# EasyEDA Pro project ProPrj_感应灯_2024-03-13_07-09-23_2025-06-12.epro

# Schematic 感应灯
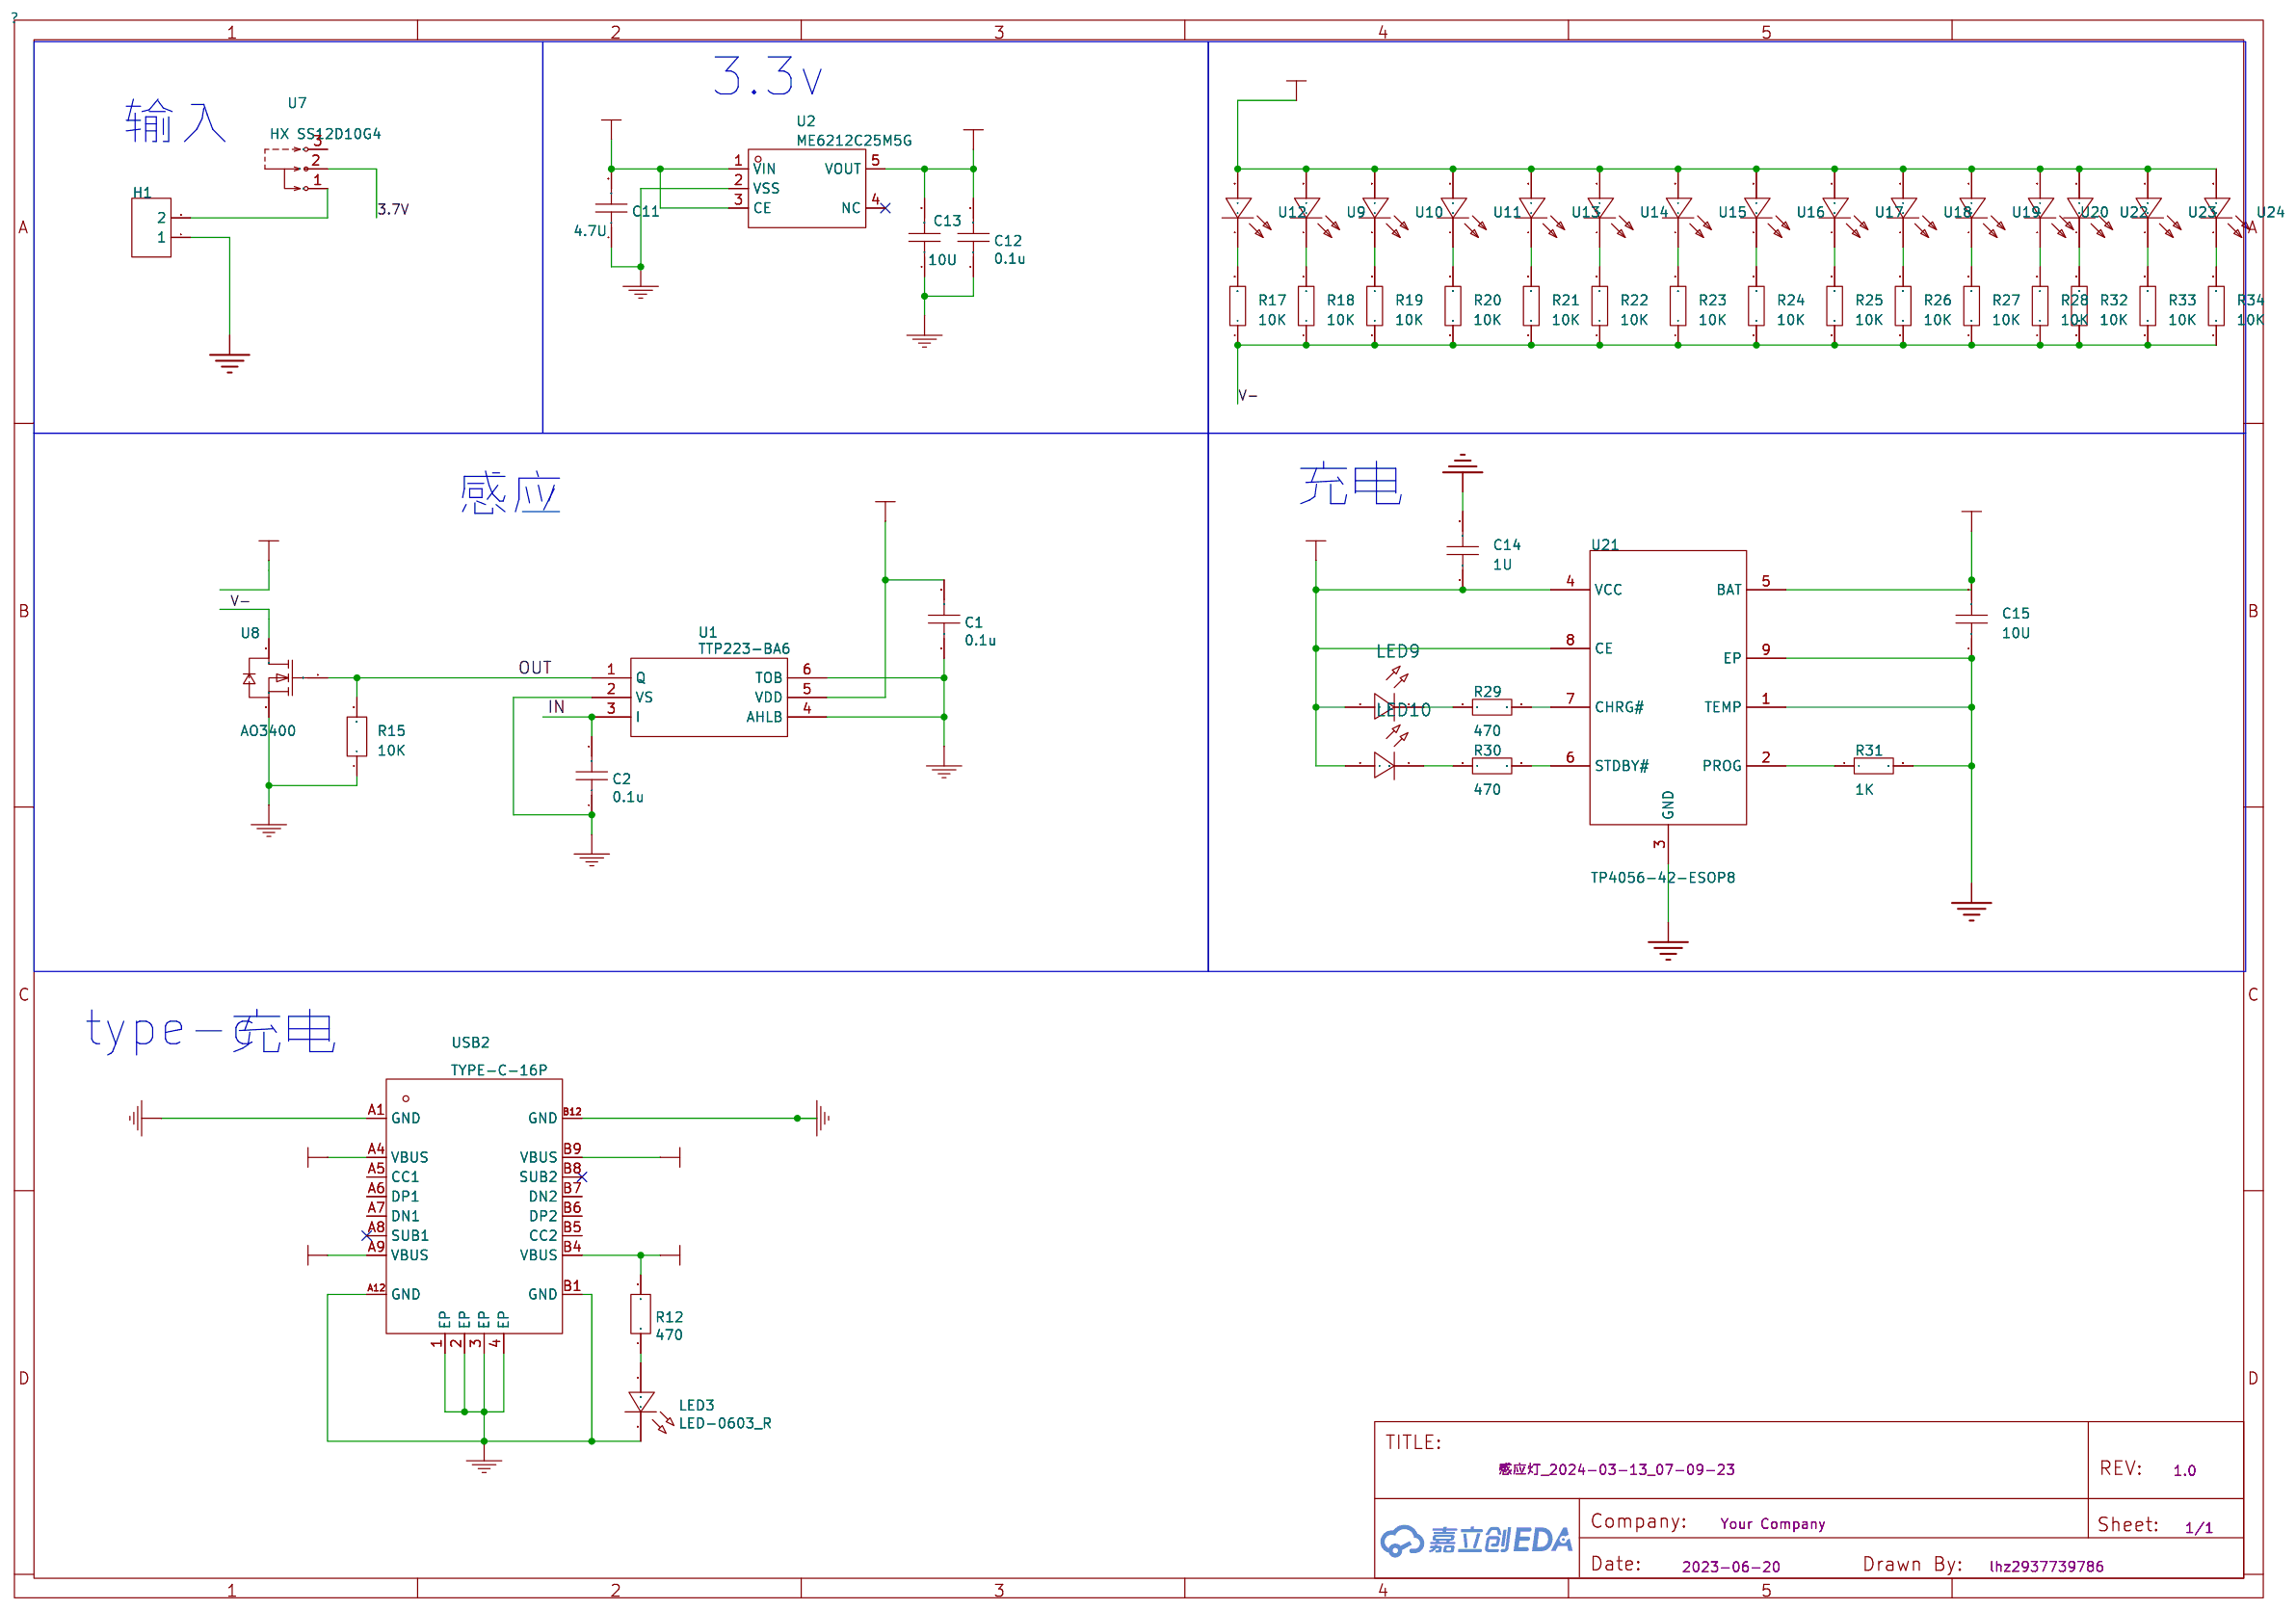
[diagram p0: schematic sheet]

## Parts
C1  0.1u  [footprint_1e94]
C2  0.1u  [footprint_1e94]
C11  4.7U  [footprint_d063]
C12  0.1u  [footprint_d063]
C13  10U  [footprint_d063]
C14  1U  [C0603]
C15  10U  [C0603]
H1  -  [HDR-TH_2P-P2.54-V-F]
LED3  LED-0603_R  [footprint_1210]
LED9  -  [LED_0603]
LED10  -  [LED_0603]
R12  470  [footprint_1dde]
R15  10K  [footprint_4dfc]
R17  10K  [R0805]
R18  10K  [R0805]
R19  10K  [R0805]
R20  10K  [R0805]
R21  10K  [R0805]
R22  10K  [R0805]
R23  10K  [R0805]
R24  10K  [R0805]
R25  10K  [R0805]
R26  10K  [R0805]
R27  10K  [R0805]
R28  10K  [R0805]
R29  470  [R0805]
R30  470  [R0805]
R31  1K  [R0805]
R32  10K  [R0805]
R33  10K  [R0805]
R34  10K  [R0805]
U1  TTP223-BA6  [footprint_07fe]
U2  ME6212C25M5G  [footprint_203e]
U7  HX SS12D10G4  [footprint_a0a6]
U8  AO3400  [footprint_8e82]
U9  -  [led-smd_l3.5-w2.8-r-fd-white]
U10  -  [led-smd_l3.5-w2.8-r-fd-white]
U11  -  [led-smd_l3.5-w2.8-r-fd-white]
U12  -  [led-smd_l3.5-w2.8-r-fd-white]
U13  -  [led-smd_l3.5-w2.8-r-fd-white]
U14  -  [led-smd_l3.5-w2.8-r-fd-white]
U15  -  [led-smd_l3.5-w2.8-r-fd-white]
U16  -  [led-smd_l3.5-w2.8-r-fd-white]
U17  -  [led-smd_l3.5-w2.8-r-fd-white]
U18  -  [led-smd_l3.5-w2.8-r-fd-white]
U19  -  [led-smd_l3.5-w2.8-r-fd-white]
U20  -  [led-smd_l3.5-w2.8-r-fd-white]
U21  TP4056-42-ESOP8  [ESOP-8_L4.9-W3.9-P1.27-LS6.0-BL-EP]
U22  -  [led-smd_l3.5-w2.8-r-fd-white]
U23  -  [led-smd_l3.5-w2.8-r-fd-white]
U24  -  [led-smd_l3.5-w2.8-r-fd-white]
USB2  TYPE-C-16P  [footprint_feef]

## Library data of the parts
C1 C2 C12 = 0.1u
C11 = 4.7U
C13 = 10U
C14 C15 = CAP_0603: Supplier Footprint: 0603
H1 = HDR-F_2.54_1x2P: Supplier Part: C49661; Supplier Footprint: 插件
LED3 = LED-0603_R: Manufacturer: EVERLIGHT(台湾亿光); Manufacturer Part: 19-217/R6C-AL1M2VY/3T; Supplier Part: C72044; Supplier: LCSC
LED9 LED10 = LED_0603-R: Supplier Footprint: 0603
R12 = 470
R15 = 10K
R17-R34 = Res_0805: Supplier Footprint: 0805
U1 = TTP223-BA6: Supplier: LCSC; Manufacturer: null; Supplier Part: C80757; JLCPCB Part Class: Extended Part
U2 = ME6212C25M5G: Supplier: LCSC; Supplier Part: C2911282; Manufacturer: MICRONE(南京微盟); JLCPCB Part Class: Extended Part; link: https://so.szlcsc.com/global.html?k=C2911282&amp;ref=editor
U7 = HX SS12D10G4: Supplier: LCSC; Supplier Part: C5149841; Manufacturer: hanxia(韩下); link: https://atta.szlcsc.com/upload/public/pdf/source/20220907/2020D7183ED16DD6E2B9F5A13FB144CF.pdf; JLCPCB Part Class: Extended Part
U8 = AO3400: Supplier: LCSC; Supplier Part: C5224189; Manufacturer: ElecSuper(静芯微）; JLCPCB Part Class: Extended Part; link: https://so.szlcsc.com/global.html?k=C5224189&amp;ref=editor
U9-U20 U22-U24 = led2835: LCSC Part Name: LED2835; Supplier Part: C9900002597; Manufacturer Part: LED2835; LCSC Stock: 0; LCSC On Sale: 0; Supplier Footprint: 2835; Price: 0; JLCPCB Part Class: Extended Part; JLCPCB Stock: 0; JLCPCB On Sale: 1; Datasheet: 2021-11-27/497147W/184e61ff2eea470fa2087b84cc62277a/C28438762835白色.PDF; Supplier: LCSC
U21 = TP4056: 充电电池的类型:-;电池单元组数:-;最大充电电流:-;充满的电池组电压:-;最大供应电压:-;; Supplier Part: C16581; Manufacturer: TOPPOWER(南京拓微); Supplier Footprint: ESOP-8; JLCPCB Part Class: Basic Part; Datasheet: https://atta.szlcsc.com/upload/public/pdf/source/20190626/C16581_611BCF5D7CF554EAE465137A8F68DB3E.pdf; Supplier: LCSC
USB2 = TYPE-C-16P: Supplier: LCSC; Supplier Part: C709357; Manufacturer: Shenzhen Kinghelm Elec; Manufacturer Part: KH-TYPE-C-16P; JLCPCB Part Class: Extended Part

## Nets
3.3V: C1.2 C12.2 C13.2 U1.5(VDD) U2.5(VOUT)
3.7V: C11.2 C15.2 U2.1(VIN) U2.3(CE) U7.2 U9.2(A) U10.2(A) U11.2(A) U12.2(A) U13.2(A) U14.2(A) U15.2(A) U16.2(A) U17.2(A) U18.2(A) U19.2(A) U20.2(A) U21.5(BAT) U22.2(A) U23.2(A) U24.2(A)
5V: C14.1 LED9.2(A) LED10.2(A) R12.2 U21.4(VCC) U21.8(CE) USB2.A4(VBUS) USB2.A9(VBUS) USB2.B4(VBUS) USB2.B9(VBUS)
GND: C1.1 C2.1 C11.1 C12.1 C13.1 C14.2 C15.1 H1.1 LED3.2 R15.1 R31.2 U1.2(VS) U1.4(AHLB) U1.6(TOB) U2.2(VSS) U8.2(S) U21.1(TEMP) U21.3(GND) U21.9(EP) USB2.1(EP) USB2.2(EP) USB2.3(EP) USB2.4(EP) USB2.A1(GND) USB2.A12(GND) USB2.B1(GND) USB2.B12(GND)
IN: C2.2 U1.3(I)
OUT: R15.2 U1.1(Q) U8.1(G)
V-: R17.1 R18.1 R19.1 R20.1 R21.1 R22.1 R23.1 R24.1 R25.1 R26.1 R27.1 R28.1 R32.1 R33.1 R34.1 U8.3(D)
$1N831: H1.2 U7.1
$1N2229: R17.2 U12.1(K)
$1N2232: R18.2 U9.1(K)
$1N2235: R19.2 U10.1(K)
$1N2238: R20.2 U11.1(K)
$1N2241: R21.2 U13.1(K)
$1N2244: R22.2 U14.1(K)
$1N2247: R23.2 U15.1(K)
$1N2250: R24.2 U16.1(K)
$1N2253: R25.2 U17.1(K)
$1N2256: R26.2 U18.1(K)
$1N2259: R27.2 U19.1(K)
$1N2262: R28.2 U20.1(K)
$1N2508: R29.2 U21.7(CHRG#)
$1N2511: R30.2 U21.6(STDBY#)
$1N2564: LED9.1(C) R29.1
$1N2567: LED10.1(C) R30.1
$1N2736: R31.1 U21.2(PROG)
$1N3041: LED3.1 R12.1
$1N3274: R32.2 U22.1(K)
$1N3276: R33.2 U23.1(K)
$1N3278: R34.2 U24.1(K)

Not connected (* = marked no-connect by the designer): U2 4(NC)*; U7 3; USB2 A5(CC1) A6(DP1) A7(DN1) A8(SUB1)* B5(CC2) B6(DP2) B7(DN2) B8(SUB2)*

## Notes on the sheet
- 3.3v
- 输入
- 充电
- 感应
- type-c
- 充电

# Board PCB_感应灯
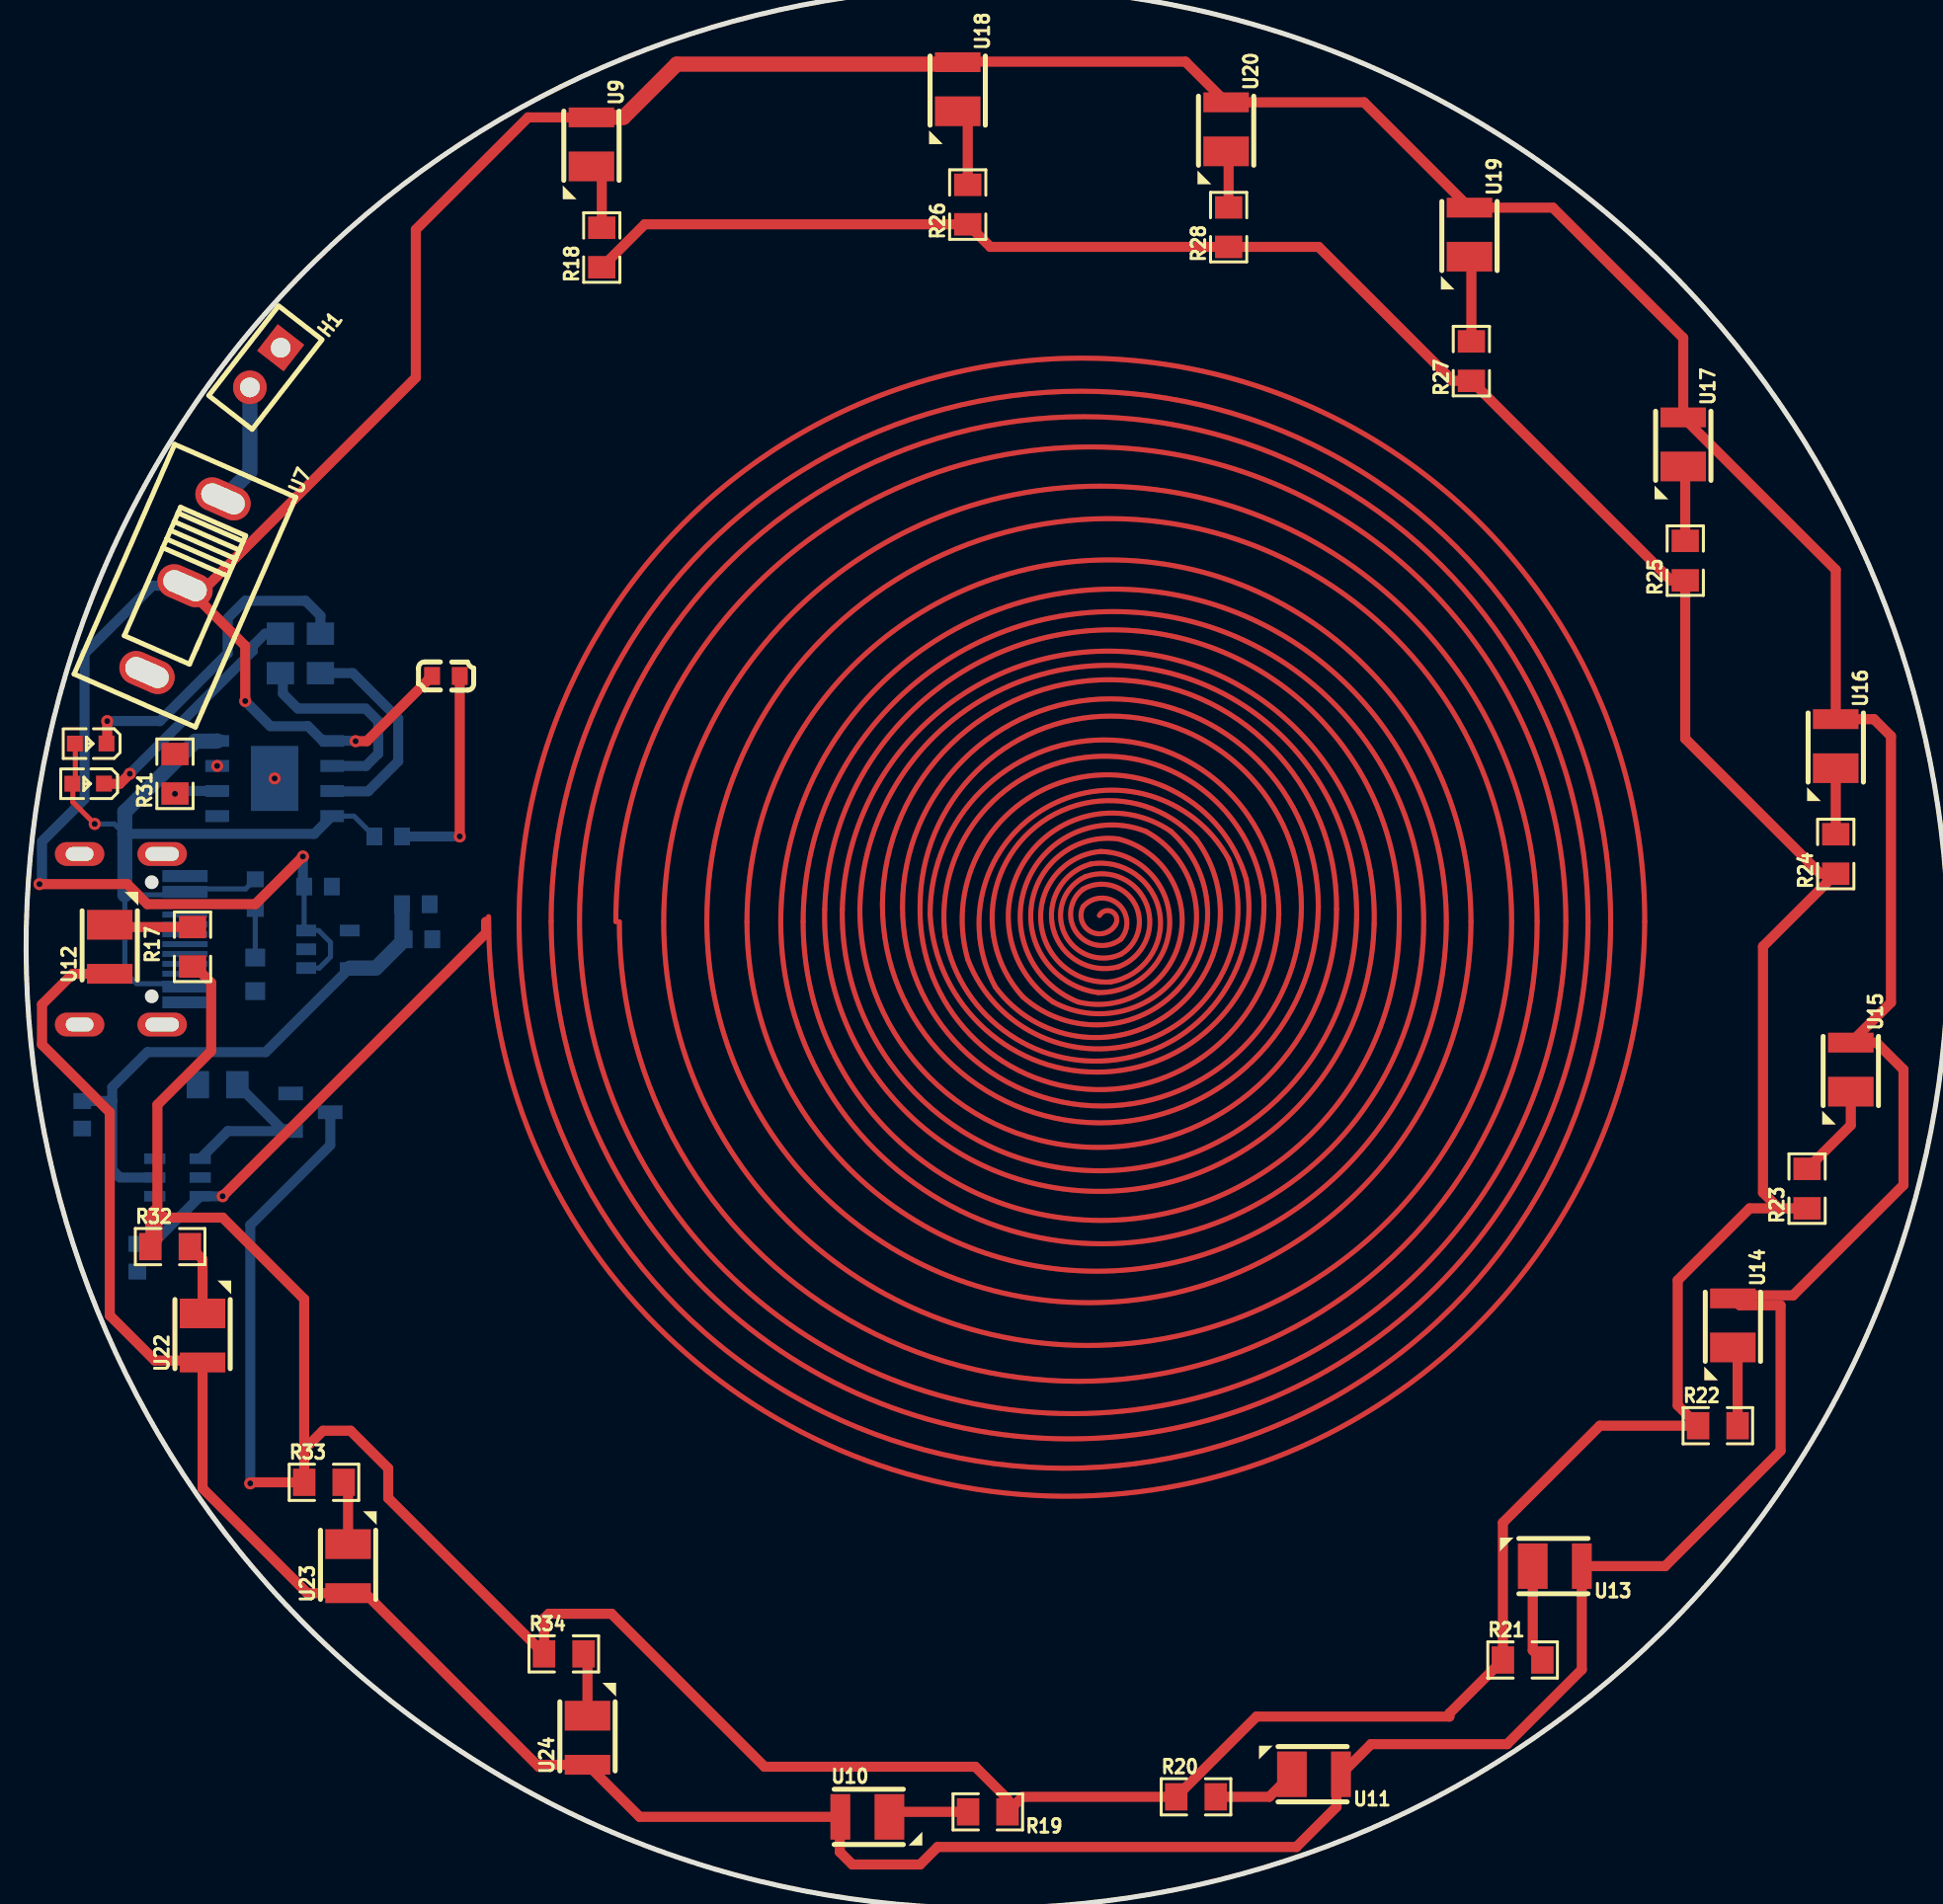
[diagram p1: board, top side]
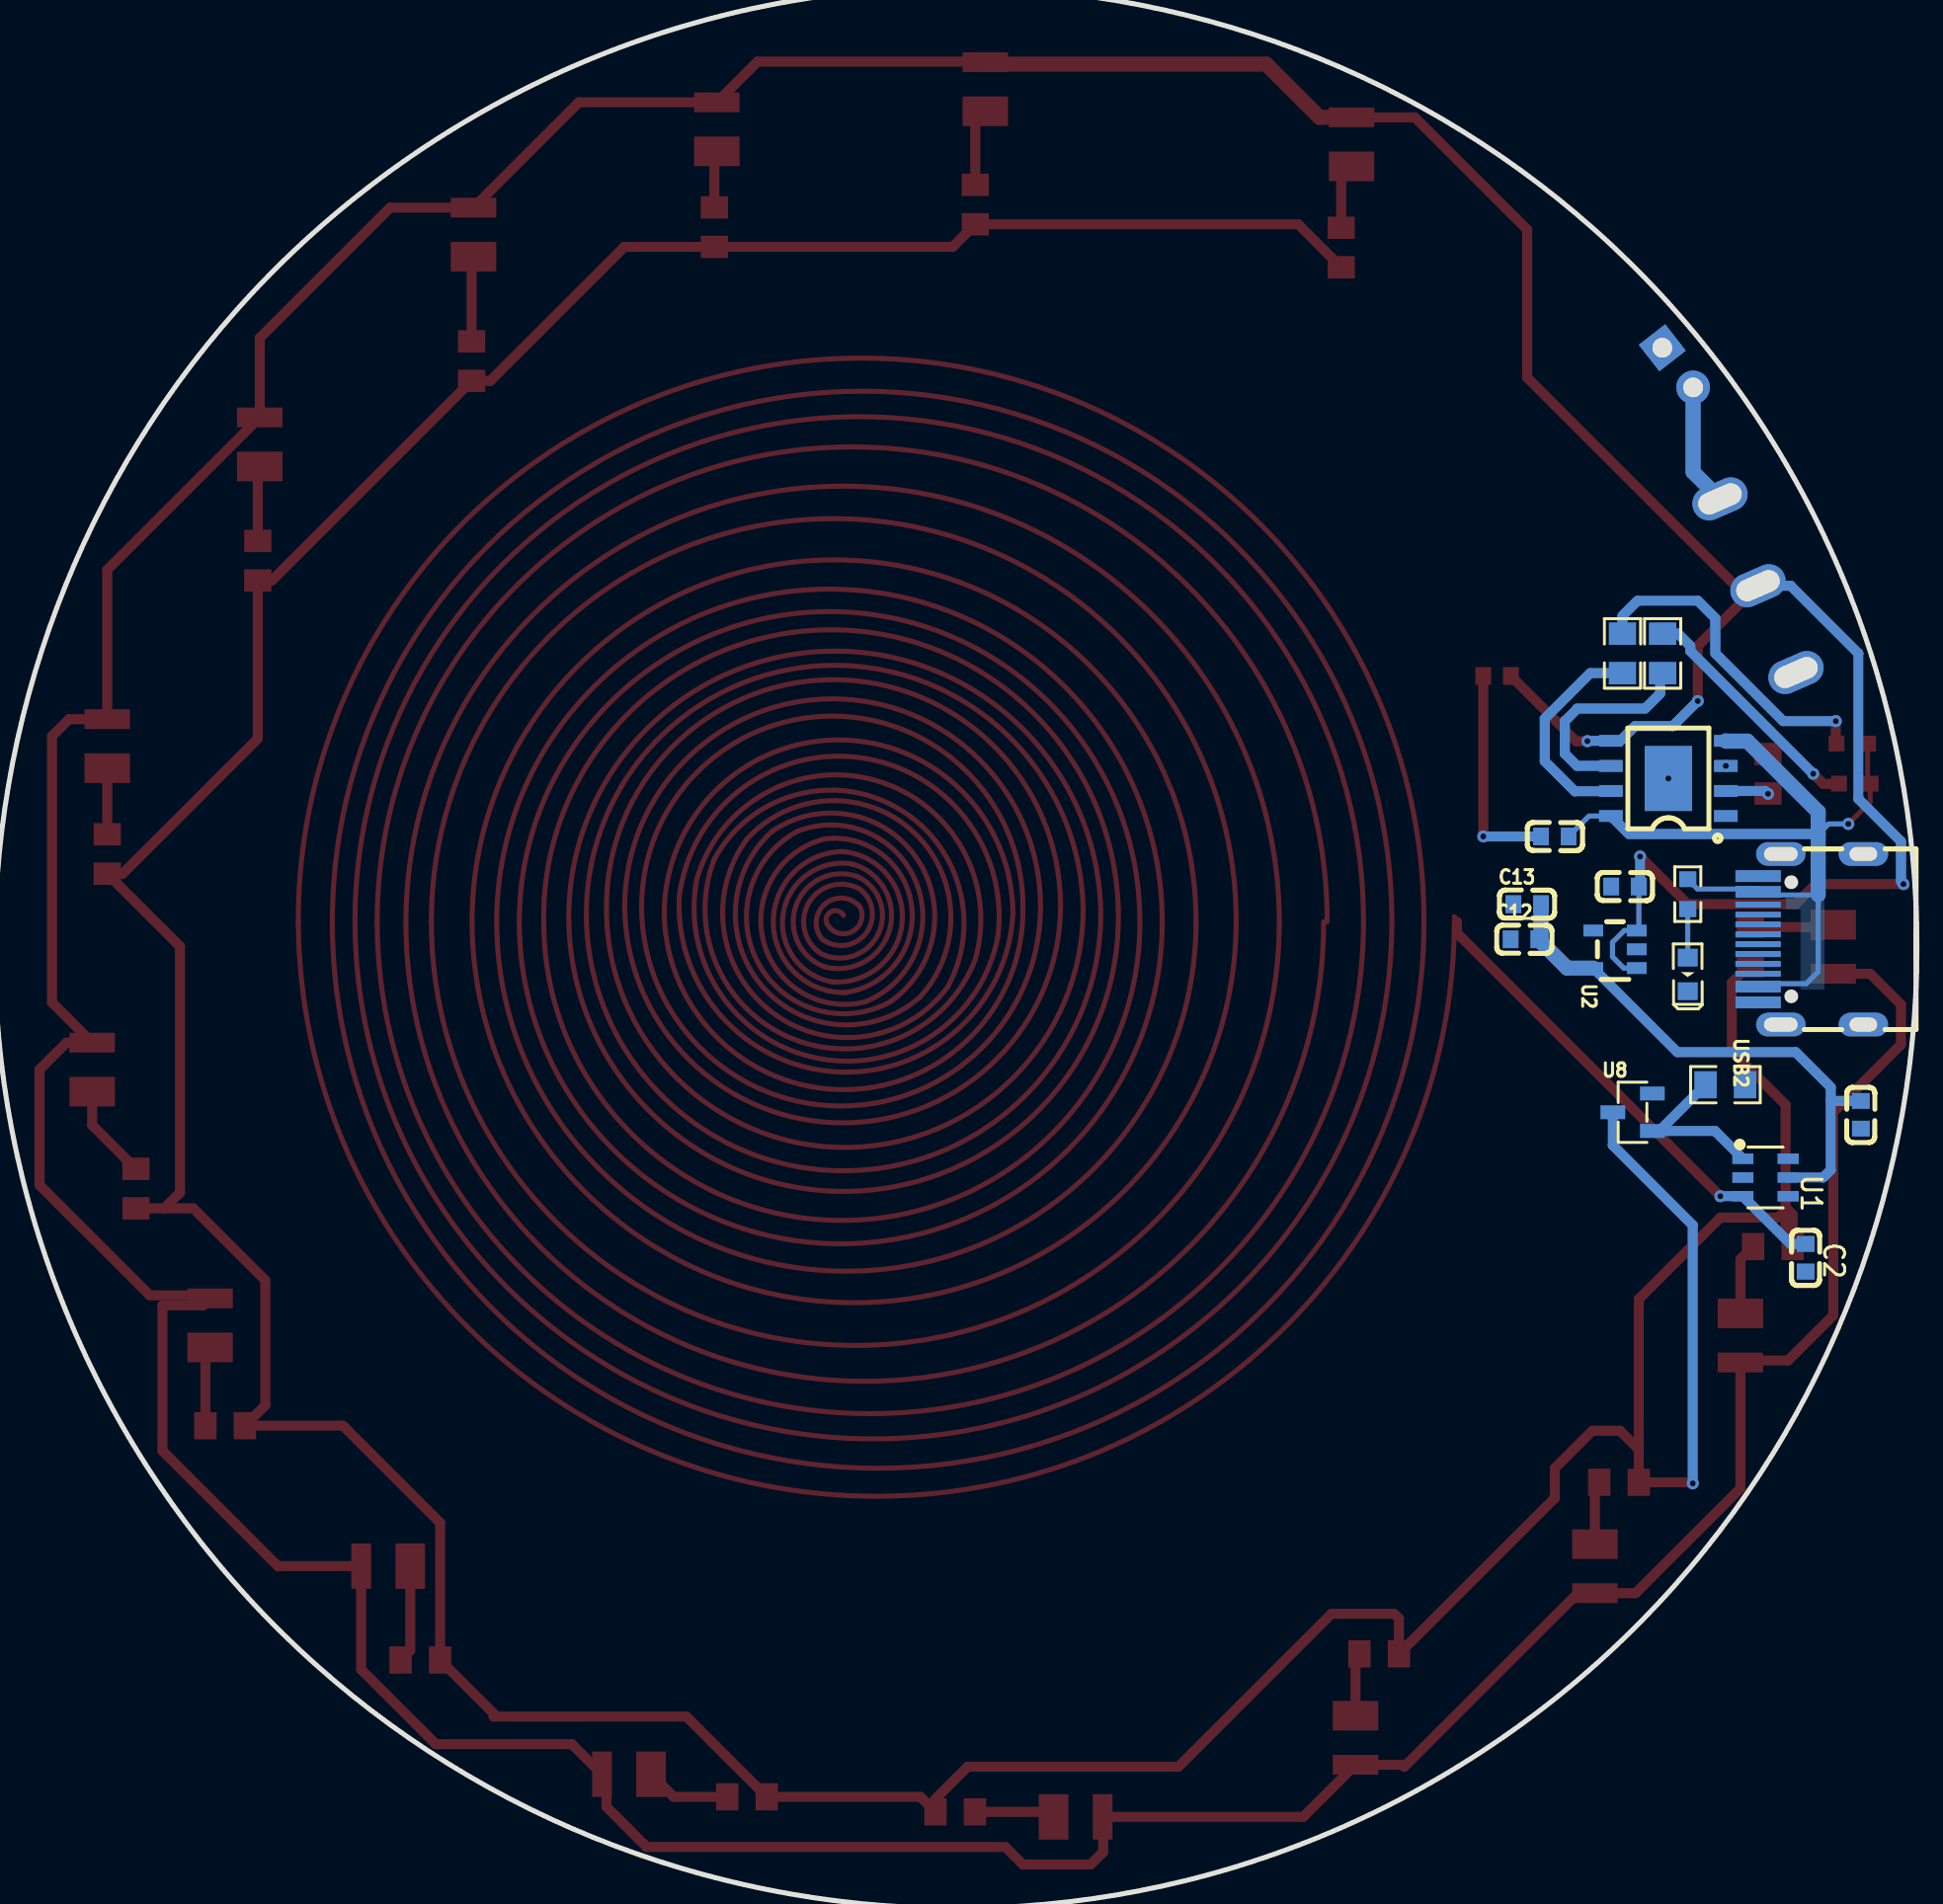
[diagram p2: board, bottom side, seen from below]

Outline 97.3 x 97.3 mm; copper layers: Top Layer, Bottom Layer. Coordinates in mm from the lower left corner of the outline.
Outline path: 89.7,22.53 arc(7.48,74.56) 89.7,22.54
Stack: Top Layer 0.035mm / Dielectric1 1.51mm FR4 er 4.5 / Bottom Layer 0.035mm

## Design rules (mm)
spacing Default (default): track to track 0.152, other pairs 0 to 0.152
track width Default (default): min 0.254, default 0.254, max 25.4
differential pair differentialPair (default): width min 0.127, default 0.254, max 2.54; gap min 0.152, default 0.152
via Default (default): diameter min 0.61, default 0.61, max 100.025; hole min 0.305, default 0.305, max 59.995
net GND uses gge1959

## Placement (name value [footprint] x y rotation side)
C1  0.1u  [footprint_1e94]  2.84 40.19 90 bottom
C2  0.1u  [footprint_1e94]  5.63 32.95 90 bottom
C11  4.7U  [footprint_d063]  14.77 51.75 180 bottom
C12  0.1u  [footprint_d063]  19.86 49.08 180 bottom
C13  10U  [footprint_d063]  19.73 50.86 180 bottom
C14  1U  [C0603]  18.33 54.29 0 bottom
C15  10U  [C0603]  21.25 62.41 180 top
H1  -  [HDR-TH_2P-P2.54-V-F]  12.11 78.03 232.1 top
LED3  LED-0603_R  [footprint_1210]  11.6 47.3 270 bottom
LED9  -  [LED_0603]  3.22 58.98 180 top
LED10  -  [LED_0603]  3.09 56.95 180 top
R12  470  [footprint_1dde]  11.6 51.36 90 bottom
R15  10K  [footprint_4dfc]  9.69 41.71 0 bottom
R17  10K  [R0805]  8.42 48.7 90 top
R18  10K  [R0805]  29.14 84.11 90 top
R19  10K  [R0805]  48.68 4.88 180 top
R20  10K  [R0805]  59.22 5.64 0 top
R21  10K  [R0805]  75.76 12.57 0 top
R22  10K  [R0805]  85.64 24.44 0 top
R23  10K  [R0805]  90.16 36.45 90 top
R24  10K  [R0805]  91.61 53.4 90 top
R25  10K  [R0805]  83.99 68.26 90 top
R26  10K  [R0805]  47.67 86.29 90 top
R27  10K  [R0805]  73.16 78.36 90 top
R28  10K  [R0805]  60.88 85.15 90 top
R29  470  [R0805]  14.9 63.56 270 bottom
R30  470  [R0805]  12.87 63.56 270 bottom
R31  1K  [R0805]  7.54 57.46 90 top
R32  10K  [R0805]  7.29 33.51 0 top
R33  10K  [R0805]  15.08 21.57 0 top
R34  10K  [R0805]  27.22 12.88 0 top
U1  TTP223-BA6  [footprint_07fe]  7.66 37.01 270 bottom
U2  ME6212C25M5G  [footprint_203e]  15.28 48.57 90 bottom
U7  HX SS12D10G4  [footprint_a0a6]  8.04 66.99 246.4 top
U8  AO3400  [footprint_8e82]  14.39 40.32 180 bottom
U9  -  [led-smd_l3.5-w2.8-r-fd-white]  28.62 89.59 270 top
U10  -  [led-smd_l3.5-w2.8-r-fd-white]  42.33 4.63 0 top
U11  -  [led-smd_l3.5-w2.8-r-fd-white]  65.45 6.79 180 top
U12  -  [led-smd_l3.5-w2.8-r-fd-white]  4.23 48.44 90 top
U13  -  [led-smd_l3.5-w2.8-r-fd-white]  77.64 17.33 180 top
U14  -  [led-smd_l3.5-w2.8-r-fd-white]  86.4 29.77 270 top
U15  -  [led-smd_l3.5-w2.8-r-fd-white]  92.37 42.73 270 top
U16  -  [led-smd_l3.5-w2.8-r-fd-white]  91.61 59.11 270 top
U17  -  [led-smd_l3.5-w2.8-r-fd-white]  83.89 74.39 270 top
U18  -  [led-smd_l3.5-w2.8-r-fd-white]  47.16 92.39 270 top
U19  -  [led-smd_l3.5-w2.8-r-fd-white]  73.07 85.02 270 top
U20  -  [led-smd_l3.5-w2.8-r-fd-white]  60.75 90.35 270 top
U21  TP4056-42-ESOP8  [ESOP-8_L4.9-W3.9-P1.27-LS6.0-BL-EP]  12.58 57.22 90 bottom
U22  -  [led-smd_l3.5-w2.8-r-fd-white]  8.93 28.76 90 top
U23  -  [led-smd_l3.5-w2.8-r-fd-white]  16.3 17.07 90 top
U24  -  [led-smd_l3.5-w2.8-r-fd-white]  28.42 8.38 90 top
USB2  TYPE-C-16P  [footprint_feef]  5.12 49.08 90 bottom

## Footprints (pads in the part's own frame, mm; a bottom-side part is the same pattern mirrored in y, then rotated)
C0603
  rect 0.8x0.9 smd: 1(-0.7,0) 2(0.7,0)
ESOP-8_L4.9-W3.9-P1.27-LS6.0-BL-EP
  rect 0.6x1.2 smd: 1(-1.905,-2.909) 2(-0.635,-2.909) 3(0.635,-2.909) 4(1.905,-2.909) 5(1.905,2.909) 6(0.635,2.909) 7(-0.635,2.909) 8(-1.905,2.909)
  rect 3.3x2.4 smd: 9(0,0)
footprint_1dde
  rect 0.806x0.864 smd: 1(-0.753,0) 2(0.753,0)
footprint_1e94
  rect 0.8x0.9 smd: 1(-0.7,0) 2(0.7,0)
footprint_4dfc
  rect 1.133x1.377 smd: 1(-1,0) 2(1,0)
footprint_07fe
  rect 0.532x1.072 smd: 1(-0.95,-1.149) 2(0,-1.149) 3(0.95,-1.149) 4(0.95,1.149) 5(0,1.149) 6(-0.95,1.149)
footprint_8e82
  rect 1.25x0.7 smd: 1(1,-0.95) 2(1,0.95) 3(-1,0)
footprint_203e
  rect 0.6x1 smd: 1(-0.95,-1.1) 2(0,-1.1) 3(0.95,-1.1) 4(0.95,1.1) 5(-0.95,1.1)
footprint_1210
  rect 0.9x1 smd: 1(-0.85,0) 2(0.85,0)
footprint_a0a6
  oval 1.7x2.9 hole 1.1x2.3: 1(-4.8,0) 2(0.001,0) 3(4.8,0)
footprint_d063
  rect 0.8x0.9 smd: 1(-0.7,0) 2(0.7,0)
footprint_feef
  oval 1.2x2.5 hole 0.7x1.7: 1(-4.32,1.765) 2(4.32,1.765)
  oval 1.2x2.5 hole 0.7x1.4: 3(-4.32,-2.415) 4(4.32,-2.415)
  rect 0.3x2.3 smd: A1(-3.35,2.915) A4(-2.55,2.915) A5(-1.25,2.915) A6(-0.25,2.915) A7(0.25,2.915) A8(1.25,2.915) A9(2.55,2.915) A12(3.35,2.915) B1(3.05,2.915) B4(2.25,2.915) B5(1.75,2.915) B6(0.75,2.915) B7(-0.75,2.915) B8(-1.75,2.915) B9(-2.25,2.915) B12(-3.05,2.915)
HDR-TH_2P-P2.54-V-F
  rect 1.7x1.7 hole 1: 1(-1.27,0)
  round 1.7 hole 1: 2(1.27,0)
led-smd_l3.5-w2.8-r-fd-white
  rect 1.5x2.301 smd: 1(1.369,0)
  rect 1x2.301 smd: 2(-1.115,0)
LED_0603
  rect 0.8x0.8 smd: 1(-0.851,-0.01) 2(0.75,-0.005)
R0805
  rect 1.133x1.377 smd: 1(-1,0) 2(1,0)

## Nets
As in the schematic.

Pads without a net: U2 4; U7 3; USB2 A5 A6 A7 A8 B5 B6 B7 B8

## Via types
v1: diameter 0.61, hole 0.305, Top Layer to Bottom Layer, 13 vias

## Routing (per net, layer and track width the routed paths; a pad name or vN(x,y) marks a point on that pad's centre or on a via; arc(x,y) is an arc through that point)
3.3V: length 27.8
  Bottom Layer w0.508: 4.36,40.89 4.36,41.59 6.14,43.36 12.13,43.36 U2.5 ; 4.36,40.89 4.36,40.89 C1.2 ; 4.36,40.89 4.36,37.39 4.74,37.01 U1.5
  Bottom Layer w0.762: C13.2 19.03,49.21 C12.2 17.71,47.62 U2.5
3.7V: length 363.8
  Top Layer w0.508: 47.41,93.53 58.69,93.53 U20.2 67.73,91.47 U19.2 77.29,86.13 83.89,79.53 U17.2 91.61,67.79 U16.2 93.54,60.23 94.4,59.37 94.4,45.88 U15.2 93.67,43.84 95.04,42.47 95.04,36.63 89.45,31.04 86.56,31.04 U14.2 86.76,30.54 88.82,30.54 88.82,23.17 82.97,17.33 U13.2 78.75,12.09 74.97,8.31 68.09,8.31 U11.2 66.34,6.56 66.34,5.14 64.3,3.1 46.14,3.1 45.25,2.22 41.83,2.22 41.19,2.85 41.19,4.6 U10.2 31.06,4.63 U24.2 26.05,7.27 25.95,7.17 17.16,15.96 U23.2 14.24,15.96 8.93,21.27 U22.2 8.83,27.74 6.52,27.74 4.23,30.03 4.23,40.32 0.8,43.74 0.8,45.78 2.36,47.33 U12.2 ; v1(14.01,53.27) 11.6,50.86 6.14,50.86 5.12,51.87 v1(0.68,51.87) ; v1(11.09,61.14) 11.09,63.94 U7.2 9.19,66.99 19.73,77.53 19.73,85.02 25.41,90.71 U9.2 ; C15.2 17.25,59.11 v1(16.68,59.11)
  Top Layer w0.762: U9.2 30.24,90.71 32.94,93.4 47.06,93.4 U18.2
  Bottom Layer w0.254: U2.1 14.84,47.62 15.41,48.19 15.41,48.92 14.81,49.52 U2.3 14.07,49.63 C11.2
  Bottom Layer w0.508: v1(0.68,51.87) 0.8,52 0.8,54.03 2.96,56.19 2.96,63.56 6.39,66.99 U7.2 ; v1(11.09,61.14) 12.36,59.87 14.27,59.87 15.01,59.13 U21.5 16.66,59.13 v1(16.68,59.11) ; v1(14.01,53.27) 14.01,51.81 C11.2
5V: length 44.7
  Top Layer w0.254: v1(3.47,54.92) 2.37,56.03 2.37,56.94 2.49,57.07 2.49,58.97
  Bottom Layer w0.254: 5,54.38 4.46,54.92 v1(3.47,54.92) ; U21.8 16.6,55.32 C14.1 ; R12.2 11.11,51.63 USB2.A9 USB2.B4 5,51.33 5,47.43 5.59,46.83 USB2.B9 USB2.A4
  Bottom Layer w0.508: 5,54.38 5.02,54.41 14.58,54.41 U21.8
  Bottom Layer w0.762: 5,51.33 5,55.53 8.58,59.11 9.65,59.11 9.67,59.13
GND: length 11.3
  Top Layer w0.508: C15.1 v1(21.95,54.29)
  Bottom Layer w0.254: 8.16,52.43 8.16,52.13
  Bottom Layer w0.508: C14.2 v1(21.95,54.29)
  vias: v1(9.67,57.86) v1(12.58,57.22)
IN: length 2159.3
  Top Layer w0.254: 29.86,49.97 arc(53.9,74.01) 77.95,49.97 arc(52.98,25) 28.02,49.97 arc(53.55,75.5) 79.07,49.97 arc(52.83,23.72) 26.58,49.97 arc(53.4,76.78) 80.22,49.97 arc(52.59,22.34) 24.96,49.97 arc(53.45,78.46) 81.94,49.97 arc(52.55,20.83) 23.42,50.22 ; 54.34,50.28 arc(54.97,50.47) 55.17,49.84 arc(53.9,49.46) 53.51,50.73 arc(55.29,50.86) 55.42,49.08 arc(53.2,49.4) 53.51,51.62 arc(56.12,50.92) 55.42,48.32 arc(52.56,49.4) 53.64,52.25 arc(56.75,50.79) 55.29,47.68 arc(51.99,49.59) 53.9,52.89 arc(57.39,50.41) 54.91,46.92 arc(51.36,49.97) 54.4,53.52 arc(57.91,49.89) 54.28,46.38 arc(50.89,50.78) 55.29,54.16 arc(58.4,49.01) 53.26,45.9 arc(50.66,51.94) 56.69,54.54 arc(58.66,47.87) 51.99,45.9 arc(50.66,53.21) 57.96,54.54 arc(58.4,46.6) 50.47,46.16 arc(50.85,54.54) 59.23,54.16 arc(57.9,45.33) 49.07,46.66 arc(51.74,55.81) 60.88,53.14 arc(56.82,44) 47.67,48.06 arc(52.69,57.14) 61.77,52.13 arc(55.61,43.05) 46.53,49.2 arc(53.58,58.29) 62.66,51.24 arc(54.66,42.35) 45.77,50.35 arc(54.59,59.17) 63.42,50.35 arc(54.15,41.46) 45.26,50.73 arc(54.91,60.38) 64.56,50.73 arc(54.47,40.63) 44.37,50.73 arc(54.9,61.25) 65.42,50.73 arc(54.32,39.76) 43.35,50.86 arc(54.97,62.22) 66.34,50.6 arc(54.28,38.54) 42.21,50.6 arc(55.04,62.92) 67.36,50.09 arc(54.09,37.33) 41.32,50.6 arc(55.17,63.68) 68.25,49.84 arc(53.96,36.31) 40.43,50.6 arc(55.36,64.76) 69.52,49.84 arc(54.37,34.82) 39.34,49.97 arc(55.05,65.67) 70.75,49.97 arc(54.48,33.69) 38.21,49.97 arc(55.05,66.81) 71.9,49.97 arc(54.2,32.27) 36.5,49.97 arc(54.82,68.29) 73.15,49.97 arc(53.81,30.63) 34.46,49.97 arc(54.84,70.34) 75.21,49.97 arc(53.74,28.5) 32.28,49.97 arc(54.39,72.07) 76.5,49.97 arc(53.27,26.74) 30.04,49.97
  Top Layer w0.508: 23.29,49.97 23.29,49.4 v1(9.95,36.06)
  Bottom Layer w0.508: C2.2 6.4,33.65 U1.3 v1(9.95,36.06)
OUT: length 8.5
  Bottom Layer w0.508: U8.1 13.04,39.37 ; 13.04,39.37 R15.2 ; 13.04,39.37 10.21,39.37 U1.1
V-: length 271.3
  Top Layer w0.508: 14.08,23.3 14.14,23.3 15.03,24.19 16.43,24.19 18.33,22.28 18.33,20.77 R34.1 26.22,14.68 26.46,14.92 29.63,14.92 37.38,7.17 48.05,7.17 49.68,5.53 R19.1 50.45,5.64 R20.1 62.29,9.71 72.05,9.71 72.05,9.87 R21.1 74.76,19.53 79.67,24.44 R22.1 83.61,25.47 83.61,31.81 87.25,35.45 88.73,35.45 ; 14.08,23.3 R33.1 11.4,21.57 v1(11.35,21.52) ; 14.08,23.3 14.08,30.85 9.95,34.98 7.03,34.98 6.65,35.36 ; 88.73,35.45 87.93,36.25 87.93,48.71 R24.1 90.83,52.4 83.99,59.24 R25.1 83.27,67.26 R27.1 72.22,77.36 65.43,84.15 R28.1 48.81,84.15 R26.1 31.32,85.29 R18.1 ; 88.73,35.45 R23.1 ; 6.65,35.36 6.65,33.87 R32.1 6.29,35.13 6.52,35.36 6.65,35.36 ; 6.65,35.36 6.65,40.7 9.37,43.42 9.37,46.88 8.55,47.7 R17.1
  Bottom Layer w0.508: U8.3 15.39,38.65 11.35,34.6 v1(11.35,21.52)
$1N831: length 6.2
  Bottom Layer w0.762: H1.2 11.33,72.74 U7.1
$1N2229: length 4.2
  Top Layer w0.508: R17.2 4.35,49.7 U12.1
$1N2232: length 3.3
  Top Layer w0.508: U9.1 29.14,87.7 R18.2
$1N2235: length 4.1
  Top Layer w0.508: R19.2 43.96,4.88 U10.1
$1N2238: length 4.3
  Top Layer w0.508: U11.1 62.94,5.64 R20.2
$1N2241: length 5
  Top Layer w0.508: R21.2 76.27,13.06 U13.1
$1N2244: length 4.1
  Top Layer w0.508: R22.2 86.64,28.17 U14.1
$1N2247: length 4.8
  Top Layer w0.508: R23.2 92.37,39.66 U15.1
$1N2250: length 3.3
  Top Layer w0.508: R24.2 U16.1
$1N2253: length 3.8
  Top Layer w0.508: R25.2 83.99,72.93 U17.1
$1N2256: length 3.9
  Top Layer w0.508: U18.1 47.67,90.51 R26.2
$1N2259: length 4.3
  Top Layer w0.508: R27.2 73.16,83.55 U19.1
$1N2262: length 2.9
  Top Layer w0.508: R28.2 60.88,88.86 U20.1
$1N2508: length 11
  Bottom Layer w0.508: U21.7 15.51,56.57 17.31,56.57 18.84,58.1 18.84,60.25 16.54,62.56 R29.2
$1N2511: length 10.7
  Bottom Layer w0.508: R30.2 13,62.43 13,61.52 13.76,60.76 17.19,60.76 17.82,60.13 17.82,58.48 17.2,57.86 15.49,57.86
$1N2564: length 16.7
  Top Layer w0.508: 4.09,58.98 4.11,58.99 v1(4.11,60.13)
  Bottom Layer w0.508: R29.1 14.9,65.46 14.14,66.22 11.09,66.22 10.2,65.33 10.2,63.56 6.77,60.13 v1(4.11,60.13)
$1N2567: length 12.2
  Top Layer w0.508: 3.97,56.95 4.74,56.95 v1(5.25,57.46)
  Bottom Layer w0.508: v1(5.25,57.46) 11.47,63.68 11.47,63.94 12.09,64.56 R30.1
$1N2736: length 2.2
  Top Layer w0.508: v1(7.54,56.44) R31.1
  Bottom Layer w0.508: v1(7.54,56.44) 7.68,56.59 9.67,56.59
$1N3041: length 2.5
  Bottom Layer w0.254: R12.1 LED3.1
$1N3274: length 3.7
  Top Layer w0.508: R32.2 8.93,32.87 U22.1
$1N3276: length 3.2
  Top Layer w0.508: R33.2 16.3,21.35 U23.1
$1N3278: length 3.2
  Top Layer w0.508: R34.2 28.42,12.69 U24.1

## Copper pours and planes (outline as drawn; the poured copper is in the pictures)
5V on Bottom Layer: 4.68,51.33 6.65,51.33 6.65,50.6 4.68,50.6
5V on Bottom Layer: 4.68,50.6 5.88,50.6 5.88,46.54 4.68,46.54
GND on Top Layer: -5.67,82.35 17.57,82.35 18.84,81.08 18.84,58.1 17.7,56.95 17.7,42.09 14.52,38.92 14.52,26.35 1.69,26.35 -0.34,24.31 -0.34,77.02
GND on Bottom Layer: -5.67,84.38 14.39,84.38 20.24,78.54 20.24,56.7 20.87,56.06 20.87,53.27 22.52,51.62 22.52,47.55 16.43,41.46 16.43,28.5 12.36,24.44 3.98,24.44 -7.32,35.74 -7.32,82.73
